# Altium schematic sheet ATmega328P_Xplained_Mini_Target.SchDoc: ATmega328P Xplained Mini
size A3; Organization: ATMEL Norway; Address1: Vestre Rosten 79; Address2: N-7075 TILLER; Address3: NORWAY; DocumentNumber: A09-2323; Revision: 4; SheetNumber: 2; SheetTotal: 3; PageSetup: Record=PageOptions|CenterHorizontal=True|CenterVertical=True|PrintScale=1.01|XCorrection=1.00|YCorrection=1.00|PrintKind=1|BorderSize=5000000|LeftOffset=0|BottomOffset=0|Orientation=2|PaperLength=1000|PaperWidth=1000|Scale=100|PaperSource=7|PrintQuality=-4|MediaType=1|DitherType=10|PaperKind=A3 (297 x 420 mm)|PrintScaleMode=1
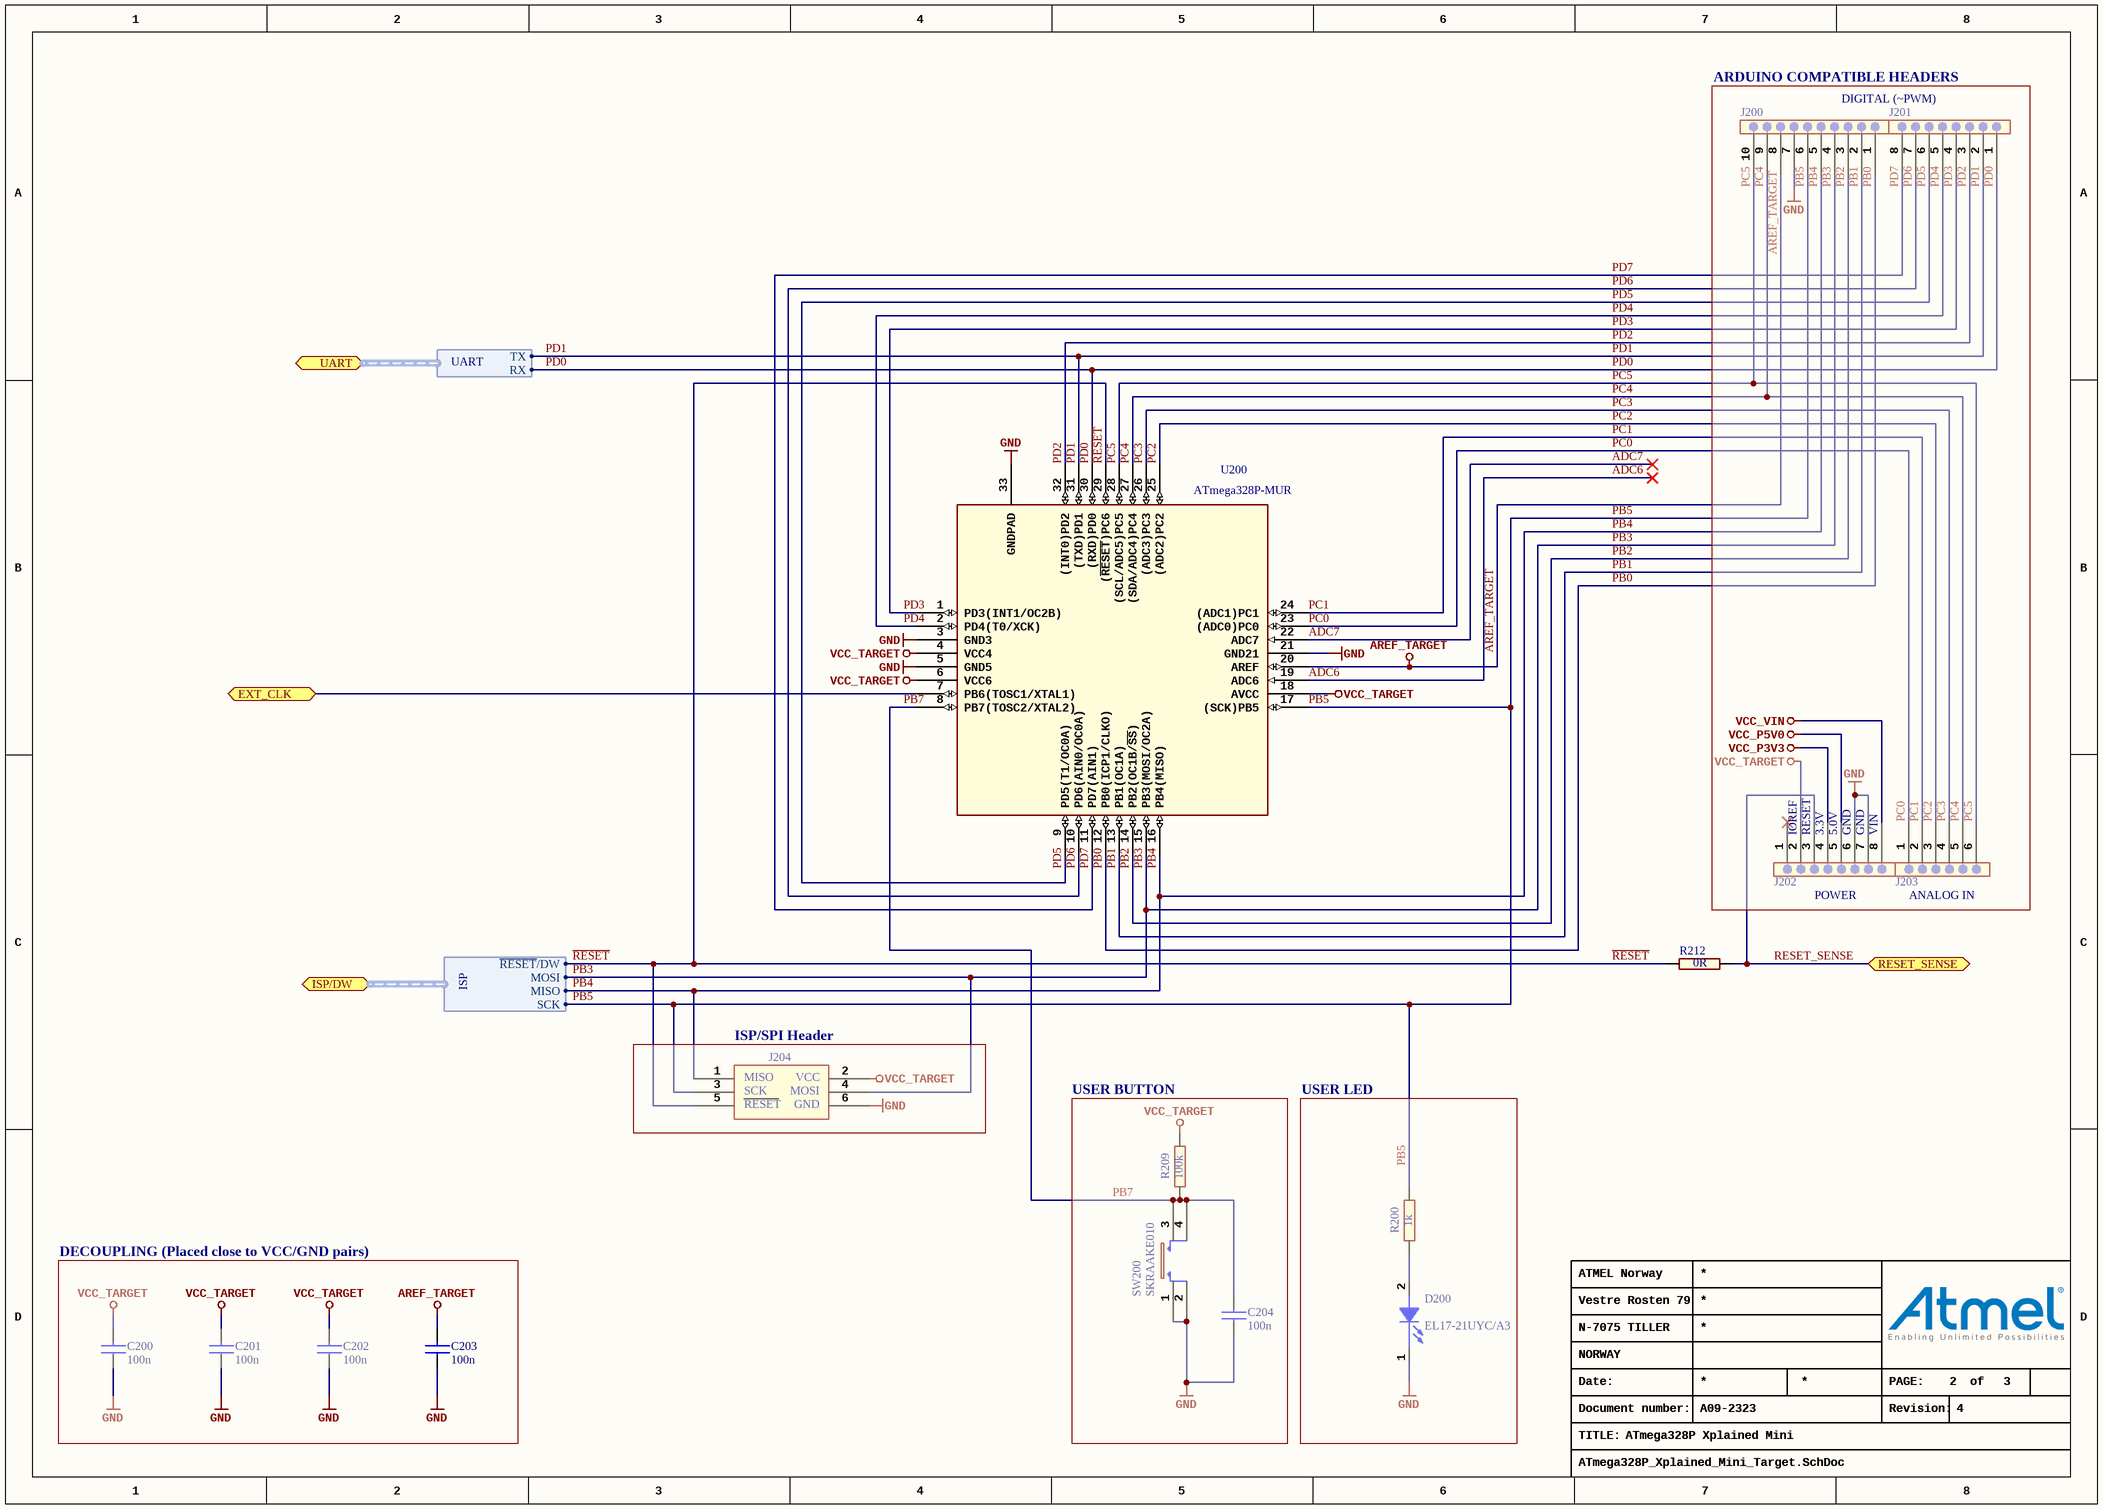
[diagram p0: ATmega328P_Xplained_Mini_Target.SchDoc]

## Parts
C200  value 100n  [AP1-00001]
C201  value 100n  [AP1-00001]
C202  value 100n  [AP1-00001]
C203  value 100n  [AP1-00001]
C204  value 100n  [AP1-00001]
D200  value EL17-21UYC/A3  [AP4-00013]
J200  (no value)  [AP8-00822]
J201  (no value)  [AP8-00823]
J202  (no value)  [AP8-00823]
J203  (no value)  [AP8-00824]
J204  (no value)  [AP8-00182]
R200  value 1k  [AP2-00000]
R209  value 100k  [AP2-00000]
R212  value 0R  [AP2-00000]
SW200  value SKRAAKE010  [AP8-00137]
U200  value ATmega328P-MUR  [AP6-00155]

## Blocks framed on the sheet
ARDUINO COMPATIBLE HEADERS: J200-J203
ISP/SPI Header: J204
USER BUTTON: C204 R209 SW200
USER LED: D200 R200
DECOUPLING (Placed close to VCC/GND pairs): C200-C203

## Ports
EXT_CLK (bidir), ISP/DW (harness ISP), RESET_SENSE, UART (harness UART)

## Harnesses
ISP: ~{RESET}/DW, MOSI, MISO, SCK
UART: RX, TX

## Nets
AREF_TARGET: C203.2 J200.8 U200.20(AREF)
GND: C200.1 C201.1 C202.1 C203.1 C204.1 D200.1(CATHODE) J200.7 J202.6 J202.7 J204.6 SW200.1 SW200.2 U200.3(GND3) U200.5(GND5) U200.21(GND21) U200.33(GNDPAD)
VCC_P3V3: J202.4
VCC_P5V0: J202.5
VCC_TARGET: C200.2 C201.2 C202.2 J202.2 J204.2 R209.2 U200.4(VCC4) U200.6(VCC6) U200.18(AVCC)
VCC_VIN: J202.8
ADC6: U200.19(ADC6)
ADC7: U200.22(ADC7)
EXT_CLK: U200.7(PB6(TOSC1/XTAL1)) ; port EXT_CLK
PB0: J200.1 U200.12(PB0(ICP1/CLKO))
PB1: J200.2 U200.13(PB1(OC1A))
PB2: J200.3 U200.14(PB2(OC1B/~{SS}))
PB3: J200.4 J204.4 U200.15(PB3(MOSI/OC2A)) ; port ISP/DW.MOSI
PB4: J200.5 J204.1 U200.16(PB4(MISO)) ; port ISP/DW.MISO
PB5: J200.6 J204.3 R200.2 U200.17((SCK)PB5) ; port ISP/DW.SCK
PB7: C204.2 R209.1 SW200.3 SW200.4 U200.8(PB7(TOSC2/XTAL2))
PC0: J203.1 U200.23((ADC0)PC0)
PC1: J203.2 U200.24((ADC1)PC1)
PC2: J203.3 U200.25((ADC2)PC2)
PC3: J203.4 U200.26((ADC3)PC3)
PC4: J200.9 J203.5 U200.27((SDA/ADC4)PC4)
PC5: J200.10 J203.6 U200.28((SCL/ADC5)PC5)
PD0: J201.1 U200.30((RXD)PD0) ; port UART.RX
PD1: J201.2 U200.31((TXD)PD1) ; port UART.TX
PD2: J201.3 U200.32((INT0)PD2)
PD3: J201.4 U200.1(PD3(INT1/OC2B))
PD4: J201.5 U200.2(PD4(T0/XCK))
PD5: J201.6 U200.9(PD5(T1/OC0A))
PD6: J201.7 U200.10(PD6(AIN0/OC0A))
PD7: J201.8 U200.11(PD7(AIN1))
~{RESET}: J204.5 R212.1 U200.29((~{RESET})PC6) ; port ISP/DW.~{RESET}/DW
RESET_SENSE: J202.3 R212.2 ; port RESET_SENSE
NetD200_2: D200.2(ANODE) R200.1

Not connected (* = marked no-connect by the designer): J202 1*

## Notes on the sheet
- DIGITAL (~PWM)
- (near J202) IOREF
- (near J202) RESET
- (near J202) 3.3V
- (near J202) 5.0V
- (near J202) GND
- VIN
- (near J202) POWER
- ANALOG IN
- Date:
- PAGE:
- of
- TITLE:
- Document number:
- Revision:
- (in symbol A08-0538) MISO; VCC; SCK; MOSI; RESET; GND

## Library data of the parts
C200-C204 = A01-0246: Ceramic capacitor, SMD 0402, X7R, 16V, +/-10%; PartGroup: Capacitors,Ceramic,SMD 0402; Manufacturer: Kemet; MPN: C0402C104K4RACTU; TemperatureRange: -55 - +125 deg C; AN: A01-0246; Tolerance: 16V, +/-10%; Height: 0,5
D200 = A10-0019: LED, Yellow, Wave length=591nm, SMD 0805, ±70°; PartGroup: Opto,LEDs,SMD; Manufacturer: Everlight; MPN: 17-21UYC/S530-A3/TR8; TemperatureRange: -40 to +85 deg C; AN: A10-0019; Height: 1,10000002384186
J200 = A08-2026: 1x10 receptacle pin header, low insertion force, 2.54mm pitch THM, Pin in Paste; PartGroup: Mechanical devices,Connectors,Pin header receptacle; Manufacturer: SAMTEC; Value: SSQ-110-21-F-S; AN: A08-2026; Height: 8,51000022888184; MPN: SSQ-110-21-F-S
J201 J202 = A08-2025: 1x8 receptacle pin header, low insertion force, 2.54mm pitch THM, Pin in Paste; PartGroup: Mechanical devices,Connectors,Pin header receptacle; Manufacturer: SAMTEC; Value: SSQ-108-21-F-S; AN: A08-2025; Height: 8,51000022888184; MPN: SSQ-108-21-F-S
J203 = A08-2024: 1x6 receptacle pin header, low insertion force, 2.54mm pitch THM; PartGroup: Mechanical devices,Connectors,Pin header receptacle; Manufacturer: SAMTEC; Value: SSQ-106-21-F-S; AN: A08-2024; Height: 8,51000022888184; MPN: SSQ-106-21-F-S
J204 = A08-0538: 2x3 pin header, 2.54 mm pitch, THM; PartGroup: Mechanical devices,Connectors,Pin headers; Manufacturer: SAMTEC; Value: MTSW-103-08-L-D-276; TemperatureRange: max. 125 degrees; AN: A08-0538; Height: 9,60000038146973; MPN: MTSW-103-08-L-D-276
R200 = A02-0212: Thick film resistor, SMD 0402, 1/16W, 1%; PartGroup: Resistors,SMD,0402 1%; Manufacturer: ASJ; MPN: CR10-1001-FK; TemperatureRange: -55 - +125 deg C; AN: A02-0212; Tolerance: 1 %; Height: 0,349999994039536
R209 = A02-0260: Thick film resistor, SMD 0402, 1/16W, 1%; PartGroup: Resistors,SMD,0402 1%; Manufacturer: ASJ; MPN: CR10-1003-FK; TemperatureRange: -55ï¿½ to +125ï¿½C; AN: A02-0260; Tolerance: 1 %; Height: 0,349999994039536
R212 = A02-0163: RES 0.0 OHM 1/16W 0402 SMD; PartGroup: Resistors,SMD,0402 1%; Manufacturer: (n/a); MPN: RMCF0402ZT0R00; Tolerance: 1 %; TemperatureRange: -55 - +125 deg C; AN: A02-0163; Height: 0,349999994039536
SW200 = A08-0790: 6.2x6.2 mm SMD tact switch, same as A08-0091 but less force is needed; PartGroup: Mechanical devices,Switches,SMD; Manufacturer: ALPS; TemperatureRange: -30 - +90 deg C; AN: A08-0790; Height: 5,09999990463257; MPN: SKRAAKE010
U200 = A06-1117: 32k AVR with ADC/TWI/RS-232; PartGroup: Integrated Circuits,MCU, MPU, DSP,AVR MCU; Manufacturer: ATMEL; TemperatureRange: -40C to +85C; AN: A06-1117; Height: 1; MPN: ATmega328P-MUR